# Altium schematic sheet POWER.SchDoc
size A3; SheetNumber: 3; SheetTotal: 9
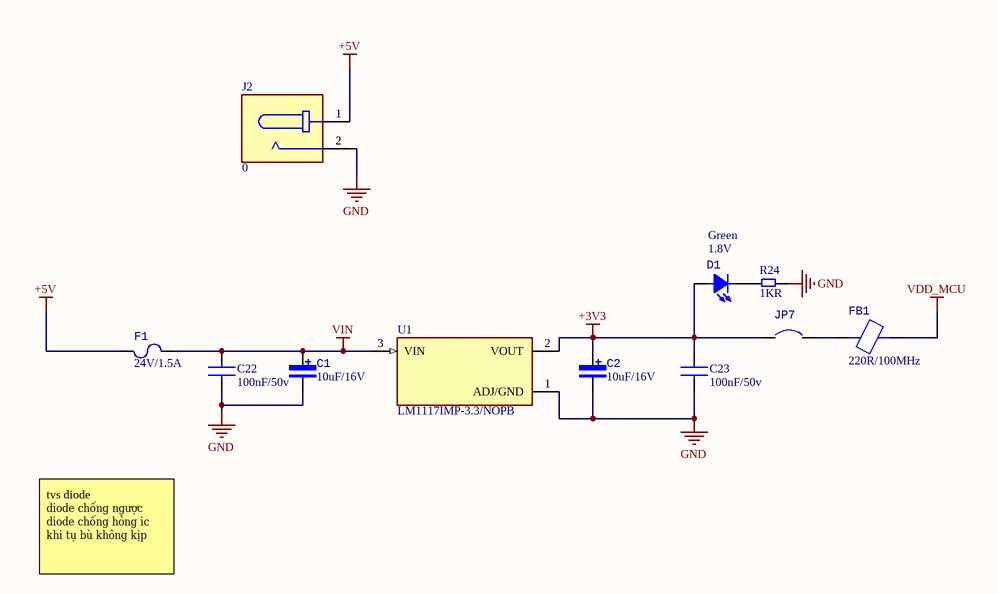
[diagram p0: POWER.SchDoc]

## Parts
C1  10uF/16V  [CAP_Tantalum_3216]
C2  10uF/16V  [CAP_Tantalum_3216]
C22  100nF/50v  [CAP-CER-0805]
C23  100nF/50v  [CAP-CER-0805]
D1  Mfr# #: Green  [LED_SMD_0805_GREEN]  (hidden comment: 1.8V)
F1  24V/1.5A  [FUSER_MF-MSMF150/24X-2]
FB1  220R/100MHz  [FERRITE-0603]
J2  0  [CUI_PJ-037AH]
JP7  JUMPER-2POS  [JUMPER-2POS-2.54]  (value not drawn)
R24  1KR  [RES-SMD-0805]
U1  LM1117IMP-3.3/NOPB  [LM1117IMP-3.3/NOPB]

## Nets
+3V3: C2.1 C23.2 D1.1(A) JP7.1 U1.2(VOUT)
+5V: F1.2 J2.1
GND: C1.2 C2.2 C22.1 C23.1 J2.2 R24.2 U1.1(ADJ/GND)
VDD_MCU: FB1.2
VIN: C1.1 C22.2 F1.1 U1.3(VIN)
NetD1_2: D1.2(K) R24.1
NetFB1_1: FB1.1 JP7.2

## Notes on the sheet
- tvs diode
  diode chống ngược
  diode chống hỏng ic khi tụ bù không kịp

## Library data of the parts
C1 C2 = ID-25: Tụ Tantalum 10uF 16V 1206 TAJA106K016RNJ; Design Item ID: ID-25; Value: 10uF/16V
C22 C23 = CAP-CER
D1 = ID-26: LED Xanh Lá 0805 Dán SMD Trong Suốt Harvatek; Design Item ID: ID-26; Value: 1.8V
F1 = ID-29: MF-MSMF150/24X-2 Cầu Chì Tự Phục Hồi 1812 24V 1.5A; Design Item ID: ID-29; Value: 24V/1.5A
FB1 = ID-27: Design Item ID: ID-27; Value: 220R/100MHz
J2 = JACK DC: 2.0 x 6.5 mm, 5.0 A, Horizontal, Through Hole, Dc Power Jack Connector; MF: Same Sky; MP: PJ-037AH; SnapEDA_Link: https://www.snapeda.com/parts/PJ-037AH/Same+Sky/view-part/?ref=snap; Package: None; Value: *; Check_prices: https://www.snapeda.com/parts/PJ-037AH/Same+Sky/view-part/?ref=eda
JP7 = ID-7: Design Item ID: ID-7
R24 = RES_SMD
U1 = LDO: 800-mA 15-V linear voltage regulator; MF: Texas Instruments; SnapEDA_Link: https://www.snapeda.com/parts/LM1117IMP-3.3/NOPB/Texas+Instruments/view-part/?ref=snap; Package: SOT-223-4 Texas Instruments; Value: *; MP: LM1117IMP-3.3/NOPB; Check_prices: https://www.snapeda.com/parts/LM1117IMP-3.3/NOPB/Texas+Instruments/view-part/?ref=eda